# Altium schematic sheet ESP.SchDoc
size A; SheetNumber: 7; SheetTotal: 9
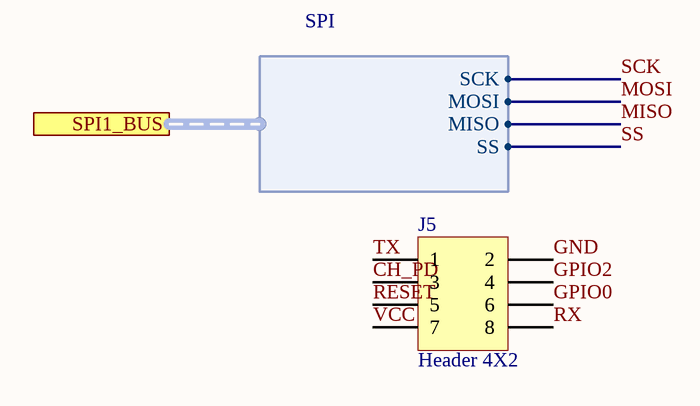
[diagram p0: ESP.SchDoc]

## Parts
J5  Header 4X2  [HDR2X4]

## Ports
SPI1_BUS (harness SPI)

## Harnesses
SPI: SCK, MOSI, MISO, SS

## Nets
CH_PD: J5.3
GND: J5.2
GPIO0: J5.6
GPIO2: J5.4
MISO: port SPI1_BUS.MISO
MOSI: port SPI1_BUS.MOSI
RESET: J5.5
RX: J5.8
SCK: port SPI1_BUS.SCK
SS: port SPI1_BUS.SS
TX: J5.1
VCC: J5.7

## Library data of the parts
J5 = Header 4X2: Header, 4-Pin, Dual row; LatestRevisionDate: 17-Jul-2002; LatestRevisionNote: Re-released for DXP Platform.; Publisher: Altium Limited